# EAGLE design SparkFun_LSM303C_6_DOF_IMU_Breakout (EAGLE 7.4.0)
DESIGNER: Brent Wilkins; VERSION: v10
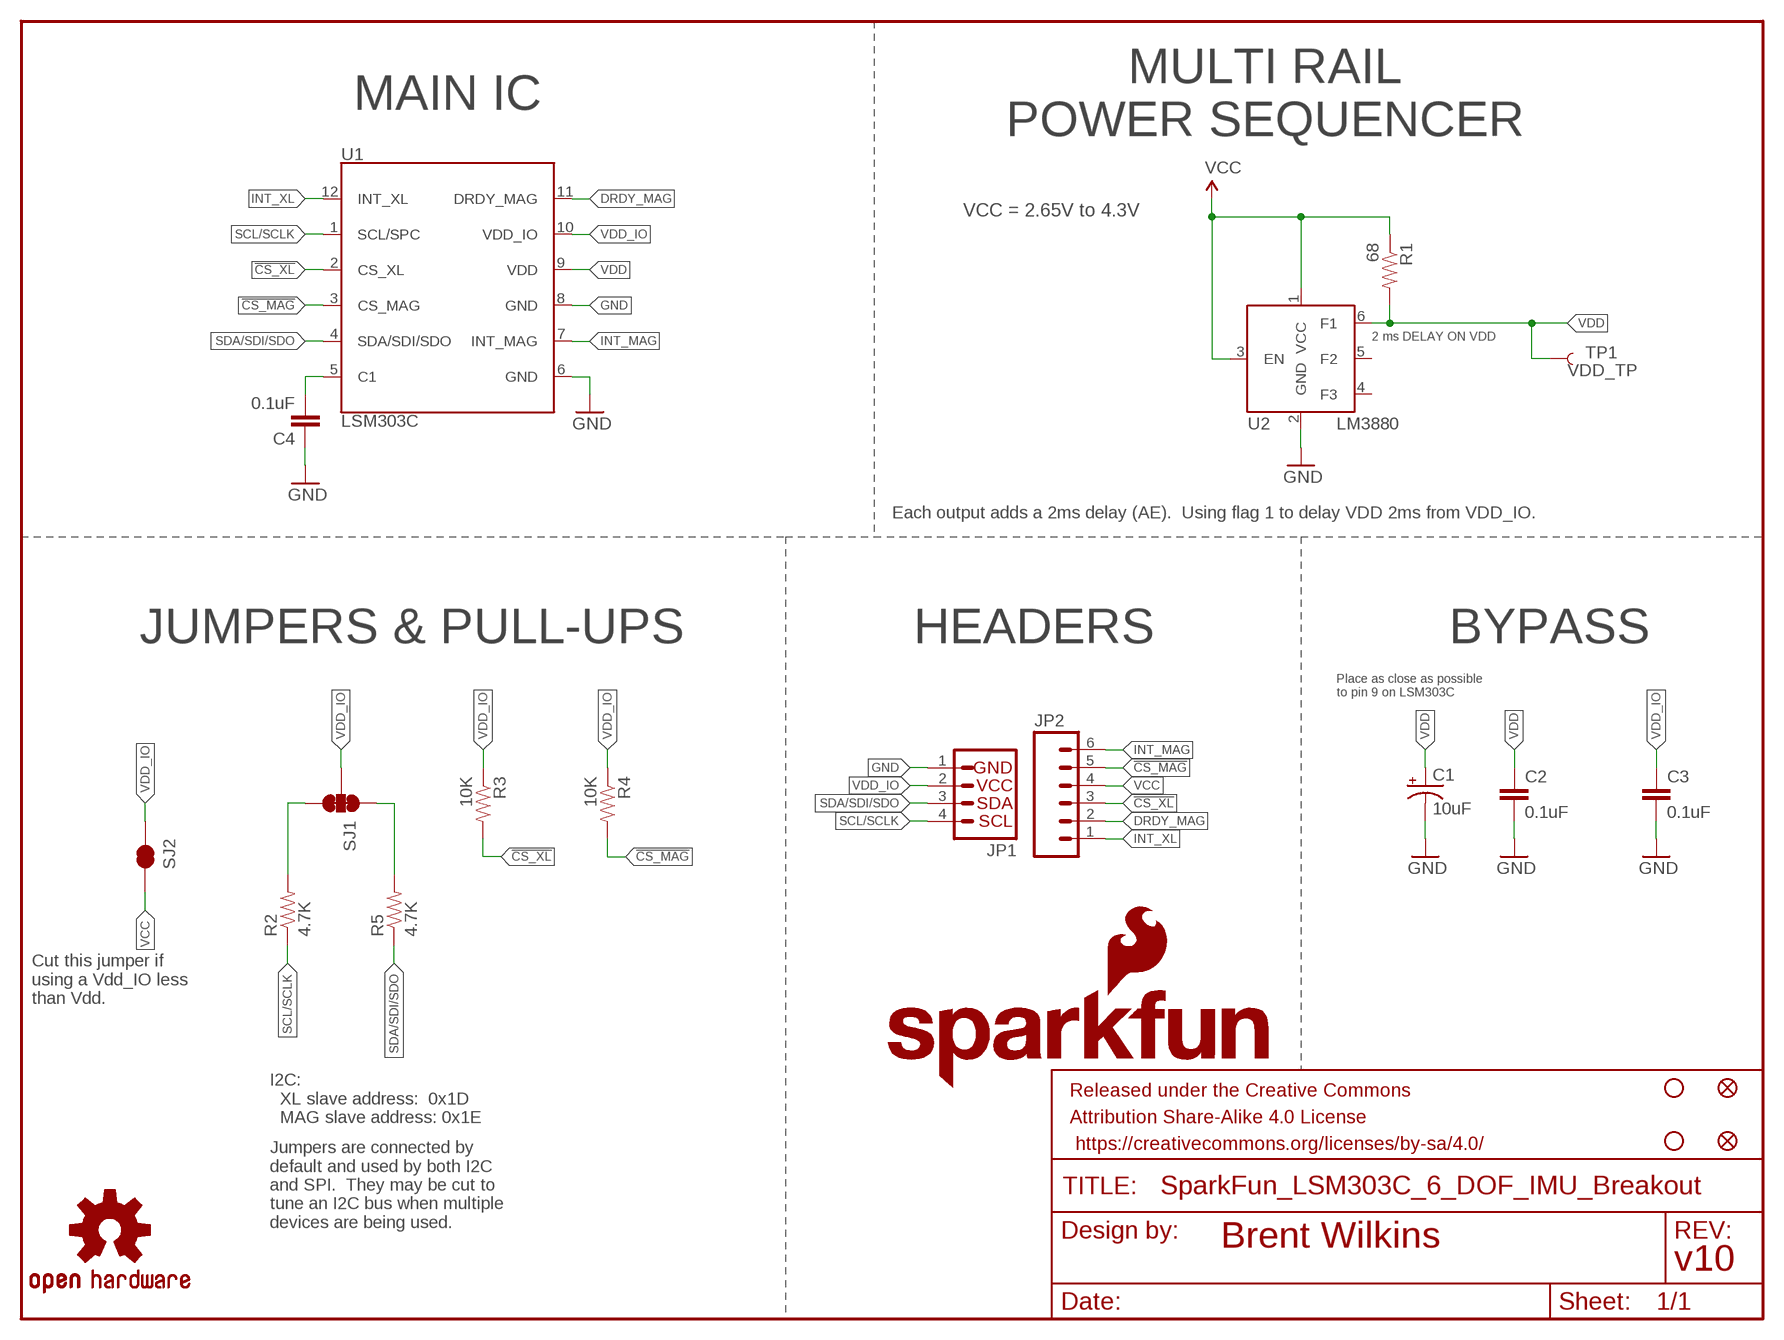
[diagram p0: schematic, sheet 1]

## Parts
C1  10uF  CAP_POL1206  [EIA3216]
C2  0.1uF  0.1UF-25V(+80/-20%)(0603)  [0603-CAP]
C3  0.1uF  0.1UF-25V(+80/-20%)(0603)  [0603-CAP]
C4  0.1uF  0.1UF-25V(+80/-20%)(0603)  [0603-CAP]
FID1  FIDUCIAL1X2  [FIDUCIAL-1X2]
FID2  FIDUCIAL1X2  [FIDUCIAL-1X2]
FRAME1  FRAME-LETTER  [CREATIVE_COMMONS]
JP1  I2C_STANDARD  [1X04]
JP2  M06SILK_FEMALE_PTH  [1X06]
LOGO1  SFE_LOGO_NAME.1_INCH  [SFE_LOGO_NAME_.1]
LOGO2  SFE_LOGO_FLAME.1EXP  [SFE_LOGO_FLAME_COPPER_EXPOSED_.1]
R1  68  RESISTOR0603-RES  [0603-RES]
R2  4.7K  4.7KOHM-1/10W-1%(0603)  [0603-RES]
R3  10K  10KOHM-1/10W-1%(0603)0603  [0603-RES]
R4  10K  10KOHM-1/10W-1%(0603)0603  [0603-RES]
R5  4.7K  4.7KOHM-1/10W-1%(0603)  [0603-RES]
SJ1  JUMPER-PAD-3-NC_BY_TRACE  [PAD-JUMPER-3-3OF3_NC_BY_TRACE_YES_SILK_FULL_BOX]
SJ2  JUMPER-PAD-2-NC_BY_TRACE  [PAD-JUMPER-2-NC_BY_TRACE_YES_SILK]
STANDOFF1  STAND-OFF  [STAND-OFF]
STANDOFF2  STAND-OFF  [STAND-OFF]
TP1  VDD_TP  TEST-POINTTP_15TH_THRU  [TP_15TH]
U1  LSM303C  [LGA-12]
U2  LM3880  LM3880/-QI  [SOT23-6]
U$8  OSHW-LOGOS  [OSHW-LOGO-S]

## Nets
!CS_MAG: JP2.5 R4.2 U1.3(CS_MAG)
!CS_XL: JP2.3 R3.2 U1.2(CS_XL)
DRDY_MAG: JP2.2 U1.11(DRDY_MAG)
GND: C1.C(-) C2.2 C3.2 C4.1 JP1.1 U1.6(GND) U1.8(GND) U2.2(GND)
I2C-UP: R5.2 SJ1.1
INT_MAG: JP2.6 U1.7(INT_MAG)
INT_XL: JP2.1 U1.12(INT_XL)
N$1: C4.2 U1.5(C1)
N$2: R2.2 SJ1.3
SCL/SCLK: JP1.4 R2.1 U1.1(SCL/SPC)
SDA/SDI/SDO: JP1.3 R5.1 U1.4(SDA/SDI/SDO)
VCC: JP2.4 R1.1 SJ2.2 U2.1(VCC) U2.3(EN)
VDD: C1.A(+) C2.1 R1.2 TP1.P$1 U1.9(VDD) U2.6(F1)
VDD_IO: C3.1 JP1.2 R3.1 R4.1 SJ1.2 SJ2.1 U1.10(VDD_IO)
Unconnected: U2.4(F3) U2.5(F2)

## Notes on the sheet
- MAIN IC
- MULTI RAIL
  POWER SEQUENCER
- VCC = 2.65V to 4.3V
- 2 ms DELAY ON VDD
- Each output adds a 2ms delay (AE).  Using flag 1 to delay VDD 2ms from VDD_IO.
- JUMPERS & PULL-UPS | HEADERS | BYPASS
- Place as close as possible
  to pin 9 on LSM303C
- Cut this jumper if
  using a Vdd_IO less
  than Vdd.
- I2C:
    XL slave address:  0x1D
    MAG slave address: 0x1E
- Jumpers are connected by
  default and used by both I2C
  and SPI.  They may be cut to
  tune an I2C bus when multiple
  devices are being used.

## Library data of the parts
C1 = SparkFun:CAP_POL: Capacitor Polarized These are standard SMD and PTH capacitors. Normally 10uF, 47uF, and 100uF in electrolytic and tantalum varieties. Always verify the external diameter of the through hole cap, it varies with capacity, voltage, and manufacturer. The EIA devices should be standard.; PROD_ID: CAP-00811
C2-C4 = SparkFun-Capacitors:0.1UF-25V(+80/-20%)(0603): CAP-00810 Ceramic Standard decoupling cap; PROD_ID: CAP-00810
FID1 FID2 = SparkFun:FIDUCIAL: Fiducial Alignment Points Various fiducial points for machine vision alignment.
FRAME1 = SparkFun-Aesthetics:FRAME-LETTER: Schematic Frame Standard 8.5x11 US Letter frame
JP1 = SparkFun-Connectors:I2C_STANDARD: SparkFun has standardized on a pinout for all I2C based sensor breakouts. This pinout allows I2C boards to be plugged directly into the headers on Arduino Uno compatible boards, and to be daisy chained easily.
JP2 = SparkFun-Connectors:M06: Header 6 Standard 6-pin 0.1" header. Use with straight break away headers (SKU : PRT-00116), right angle break away headers (PRT-00553), swiss pins (PRT-00743), machine pins (PRT-00117), and female headers (PRT-00115). Molex polarized connector foot print use with SKU : PRT-08094 with associated crimp pins and housings. NOTES ON THE VARIANTS LOCK and LOCK_LONGPADS... This footprint was designed to help hold the alignment of a through-hole component (i.e. 6-pin header) while soldering it into place. You may notice that each hole has been shifted either up or down by 0.005 of an inch from it's more standard position (which is a perfectly straight line). This slight alteration caused the pins (the squares in the middle) to touch the edges of the holes. Because they are alternating, it causes a "brace" to hold the component in place. 0.005 has proven to be the perfect amount of "off-center" position when using our standard breakaway headers. Although looks a little odd when you look at the bare footprint, once you have a header in there, the alteration is very hard to notice. Also,if you push a header all the way into place, it is covered up entirely on the bottom side. This idea of altering the position of holes to aid alignment will be further integrated into the Sparkfun Library for other footprints. It can help hold any component with 3 or more connection pins.; PROD_ID: CONN-08437
LOGO1 = SparkFun-Aesthetics:SFE_LOGO_NAME: SFE Logo, name only This is the SparkFun name logo. The logo on the schematic will always be the same size; the package variant is the height of the flame part of the logo (or the height the flame would be, if it were drawn). Default layer for the logo on the board is tSilk.
LOGO2 = SparkFun-Aesthetics:SFE_LOGO_FLAME: SFE Logo, flame only This is the SparkFun flame logo. The logo on the schematic will always be the same size; the package variant is the height of the flame. Default layer for the logo on the board is tSilk.
R1 = SparkFun-Passives:RESISTOR: Resistor Basic schematic elements and footprints for 0603, 1206, and PTH resistors.; PROD_ID: RES-07860
R2 R5 = SparkFun-Resistors:4.7KOHM-1/10W-1%(0603): RES-07857; PROD_ID: RES-07857
R3 R4 = SparkFun-Resistors:10KOHM-1/10W-1%(0603): RES-00824; PROD_ID: RES-00824
SJ1 = SparkFun-Passives:JUMPER-PAD-3-NC_BY_TRACE
SJ2 = SparkFun-Passives:JUMPER-PAD-2-NC_BY_TRACE
STANDOFF1 STANDOFF2 = SparkFun-Electromechanical:STAND-OFF: #4 Stand Off This is the mechanical footprint for a #4 phillips button head screw. Use the keepout ring to avoid running the screw head into surrounding components. SKU : PRT-00447
TP1 = SparkFun-Passives:TEST-POINT: Bare copper test points for troubleshooting or ICT
U1 = SparkFun-DigitalIC:LSM303C: Ultra-compact high-performance eCompass module: 3D accelerometer and 3D magnetometer http://www.st.com/st-web-ui/static/active/en/resource/technical/document/datasheet/DM00089896.pdf; PROD_ID: IC-12557
U2 = SparkFun-DigitalIC:LM3880/-QI: Simple Power Sequencer Precision enable pin & 3 open-drain output flags Input Voltage Range of 2.7 V to 5.5 V Power-Up and Power-Down Control LM3880MF-1XY (Timing Designator) AF 16ms AE 2ms AA 10ms AB 30ms AC 60ms AD 120ms The timing sequence of the LM3880 is controlled entirely by the enable (EN) pin. Upon power up, all the flags are held low until this precision enable is pulled high; PROD_ID: IC-12558
U$8 = SparkFun:OSHW-LOGO: Open Source Hardware Logo This logo indicates the piece of hardware it is found on incorporates a OSHW license and/or adheres to the definition of open source hardware found here: http://freedomdefined.org/OSHW

## Board
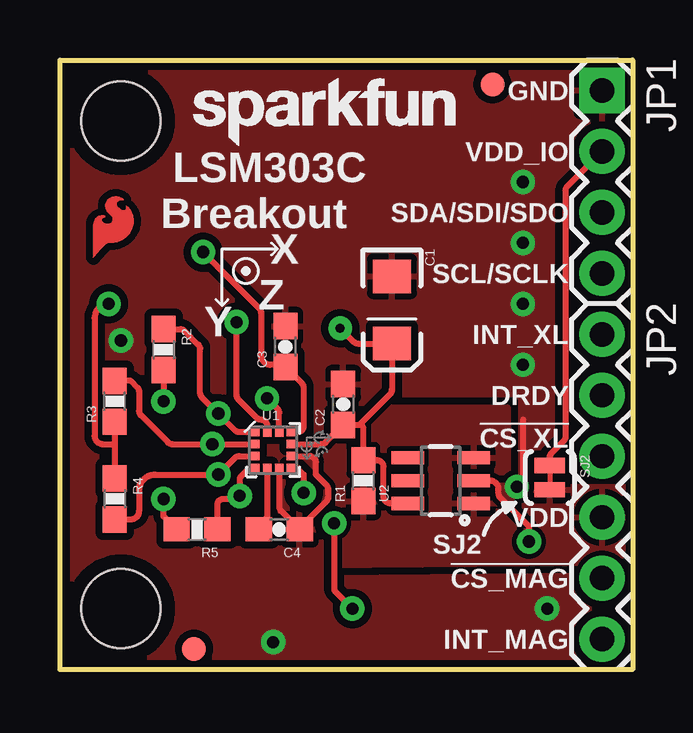
[diagram p1: board, top side]
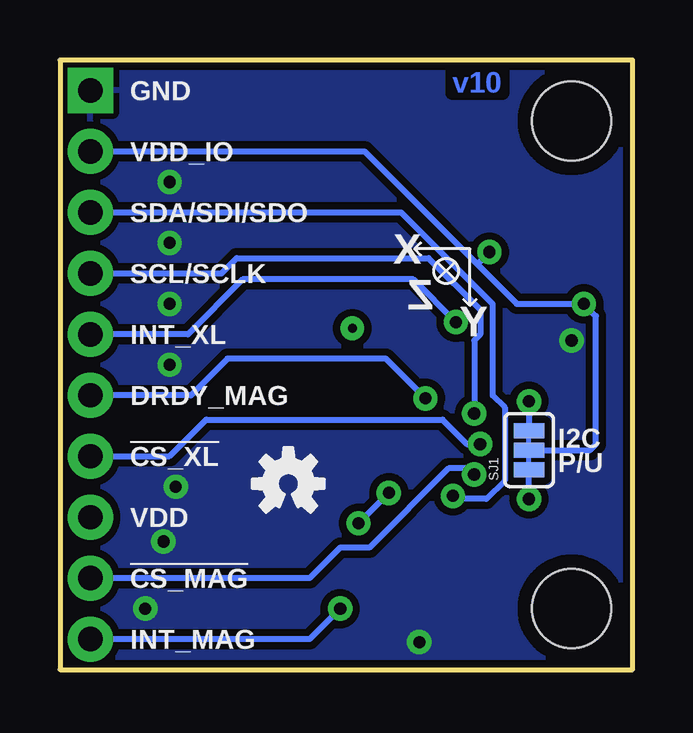
[diagram p2: board, bottom side, seen from below]

Size 23.88 x 25.4 mm. Coordinates in mm from the lower left corner, seen from the top.
Outline: 0,0 0,25.4 23.88,25.4 23.88,0 0,0
Copper layers (1*16): Top 0.035mm / dielectric 1.5mm / Bottom 0.035mm
Design rules "SparkFun-2-layer": minimum track width 7mil, minimum drill 15mil, track to track 8mil, track to pad 8mil, pad to pad 8mil, via to via 8mil, smd to smd 8mil, copper to edge 8mil, drill to drill 8mil, minimum pad ring 12mil, minimum via ring 10mil, stop-mask expansion 4mil, vias tented up to drill 20mil, thermal gap 10mil

### Footprints (pad centres in the part's own frame; a part is rotated, then mirrored left to right if it is on the bottom)
EIA3216 = smd 1.4 x 1.6: A 1.4,0; C -1.4,0
0603-CAP = smd 1.1 x 1: 1 -0.85,0; 2 0.85,0
FIDUCIAL-1X2 = smd 1 x 1: 1 0,0
1X04 = drill 1.016 pad 1.88 square: 1 0,0 | drill 1.016 pad 1.88: 2 2.54,0; 3 5.08,0; 4 7.62,0
1X06 = drill 1.016 pad 1.88: 1 0,0; 2 2.54,0; 3 5.08,0; 4 7.62,0; 5 10.16,0; 6 12.7,0
0603-RES = smd 1.1 x 1: 1 -0.85,0; 2 0.85,0
PAD-JUMPER-3-3OF3_NC_BY_TRACE_YES_SILK_FULL_BOX = smd 0.635 x 1.27: 1 -0.813,0; 2 0,0; 3 0.813,0
PAD-JUMPER-2-NC_BY_TRACE_YES_SILK = smd 0.635 x 1.27: 1 -0.508,0; 2 0.508,0
STAND-OFF = hole 3.302: 0,0
TP_15TH = drill 0.381 pad 0.61: P$1 0,0
LGA-12 = smd 0.375 x 0.35: 1 -0.75,0.75; 2 -0.75,0.25; 3 -0.75,-0.25; 4 -0.75,-0.75; 7 0.75,-0.75; 8 0.75,-0.25; 9 0.75,0.25; 10 0.75,0.75 | smd 0.35 x 0.375: 5 -0.25,-0.75; 6 0.25,-0.75; 11 0.25,0.75; 12 -0.25,0.75
SOT23-6 = smd 0.55 x 1.35: 1 -0.95,-1.375; 2 0,-1.375; 3 0.95,-1.375; 4 0.95,1.375; 5 0,1.375; 6 -0.95,1.375

### Placement (x,y rotation side)
C1  13.84,14.99 270 top
C2  11.81,11.05 90 top
C3  9.4,13.46 90 top
C4  9.14,5.84 180 top
FID1  18.03,24.38 0 top
FID2  5.59,0.86 0 top
FRAME1  -22.23,-14.1 0 top  (outside the outline)
JP1  22.61,24.13 270 top
JP2  22.61,13.97 270 top
LOGO1  5.08,21.34 0 top
LOGO2  1.07,16.81 0 top
R1  12.65,7.87 90 top
R2  4.32,13.34 270 top
R3  2.29,11.18 90 top
R4  2.29,7.11 270 top
R5  5.71,5.84 180 top
SJ1  4.32,9.14 90 bottom
SJ2  20.42,8 270 top
STANDOFF1  2.54,22.86 0 top
STANDOFF2  2.54,2.54 0 top
TP1  11.68,14.22 0 top
U1  8.89,9.14 0 top
U2  15.88,7.87 90 top
U$8  14.35,7.75 0 bottom

### Tracks (layer width: path | path; a pad name or v marks a point on that pad's centre or on a via)
!CS_MAG  (via drill 0.51)
  Top 0.254: U1.3 7.47,8.89 arc45 7.3,8.82 v6.6,8.13 3.98,8.13 arc90 3.3,7.45 3.3,6.6 arc-90 2.96,6.26 R4.2
  Bottom 0.254: v6.6,8.13 6.86,8.38 7.67,8.38 10.97,5.08 12.19,5.08 13.46,3.81 JP2.5
!CS_XL  (via drill 0.51)
  Top 0.254: U1.2 v6.35,9.39 4.68,9.39 arc-45 4.5,9.47 3.38,10.59 arc-45 3.3,10.77 3.3,11.58 arc45 3.23,11.76 2.96,12.03 R3.2
  Bottom 0.254: JP2.3 19.3,8.89 17.78,10.41 7.92,10.41 6.91,9.4 v6.36,9.4 v6.35,9.39
DRDY_MAG  (via drill 0.51)
  Top 0.254: U1.11 9.14,10.69 arc45 9.07,10.87 v8.64,11.3
  Bottom 0.254: v8.64,11.3 10.29,12.95 16.89,12.95 18.41,11.43 JP2.2
GND  (via drill 0.51)
  Top 0.254: U1.6 9.14,6.8 arc45 9.22,6.62 C4.1 | U1.8 10.41,8.89 arc-90 10.67,8.64 10.67,8.13 11.1,7.69 arc-45 11.18,7.51 11.18,7.16 arc-45 11.11,7.01 10.03,5.93 arc45 C4.1 | 9.91,5.84 C4.1 | 19.3,10.41 19.3,7.87 v19.05,7.62 | v19.56,5.33 19.56,5.97 18.36,7.17 arc-45 18.29,7.34 18.29,7.52 arc90 17.93,7.87 U2.2
  other vias: 19.3,17.78 19.3,15.24 19.3,20.32 8.89,1.14 20.32,2.54 19.3,12.7 2.54,13.72
  pour Top (isolate 0.305, rank 6): 0,0 0,25.4 23.88,25.4 23.88,0
  pour Bottom (isolate 0.305): 0,0 0,25.4 23.88,25.4 23.88,0
I2C-UP  (via drill 0.51)
  Top 0.254: R5.2 4.32,6.39 v4.32,7.11
  Bottom 0.254: v4.32,7.11 SJ1.1
INT_MAG  (via drill 0.51)
  Top 0.254: U1.7 9.89,8.39 10.16,8.13 v10.16,7.37 | v11.43,6.1 11.43,3.41 arc45 11.5,3.23 v12.19,2.54
  Bottom 0.254: JP2.6 13.46,1.27 v12.19,2.54 | v10.16,7.37 v11.43,6.1
INT_XL  (via drill 0.51)
  Top 0.254: v7.37,14.48 7.37,11.43 arc45 7.44,11.25 8.21,10.49 arc45 8.39,10.41 arc-90 8.64,10.16 U1.12 8.64,10.16
  Bottom 0.254: JP2.1 18.54,13.97 16.26,16.26 9.14,16.26 v7.37,14.48
N$1
  Top 0.254: U1.5 8.64,6.35 8.29,6.01 C4.2 8.38,5.93
N$2  (via drill 0.51)
  Top 0.254: R2.2 v4.32,11.18
  Bottom 0.254: v4.32,11.18 SJ1.3
SCL/SCLK  (via drill 0.51)
  Top 0.254: R2.1 5.01,14.19 arc-45 5.19,14.11 5.77,13.54 arc-45 5.84,13.36 5.84,11.54 arc45 5.92,11.36 v6.6,10.67 7.3,9.97 arc45 7.48,9.89 U1.1
  Bottom 0.254: JP1.4 17.14,16.51 16.51,17.14 8.51,17.14 6.35,14.99 6.35,13.97 6.6,13.72 v6.6,10.67
SDA/SDI/SDO  (via drill 0.51)
  Top 0.254: U1.4 7.89,8.39 7.57,8.07 arc45 7.49,7.9 v7.49,7.24 7.37,7.11 6.81,7.11 arc90 6.57,6.87 R5.1
  Bottom 0.254: JP1.3 9.65,19.05 5.84,15.24 5.84,11.43 5.33,10.92 5.33,7.87 6.1,7.11 7.37,7.11 v7.49,7.24
VCC
  pour Top: 23.88,7.62 23.88,4.45 10.79,4.32 10.79,10.92 18.67,10.92 18.67,7.62
VDD
  Top 0.254: 12.48,10.2 C2.1 11.08,9.47 arc-45 10.9,9.39 U1.9 | 12.48,10.2 arc-90 12.65,10.04 R1.2 13.22,8.72 arc-45 13.4,8.65 13.41,8.63 arc-45 13.49,8.46 13.49,7.24 arc90 13.8,6.92 U2.6 | 12.48,10.2 13.77,11.48 arc45 13.84,11.66 C1.A 12.43,13.59 arc-45 12.25,13.66 TP1.P$1
VDD_IO  (via drill 0.51)
  Top 0.254: U1.10 9.65,9.91 9.91,9.91 9.89,9.89 U1.10 | R3.1 2.29,9.4 | 2.29,9.4 R4.1 | v2.03,15.24 arc90 1.45,14.66 1.45,9.73 arc90 1.78,9.4 2.29,9.4 | 9.4,12.7 8.74,12.7 arc-45 8.56,12.77 8.46,12.88 arc-45 8.38,13.06 8.38,14.88 arc45 8.31,15.06 v5.97,17.4 | JP1.2 21.16,20.14 arc45 21.08,19.96 21.08,9.71 arc-45 21.01,9.53 20.5,9.02 arc45 20.42,8.84 SJ2.1 | C3.1 10.09,11.92 arc-45 10.16,11.74 10.16,10.15 arc-90 9.91,9.89 U1.10
  Top 0.406: 9.4,12.7 C3.1
  Bottom 0.254: SJ1.2 1.78,9.14 1.52,9.4 1.52,14.73 v2.03,15.24 4.83,15.24 6.48,16.89 | JP1.2 11.18,21.59 6.48,16.89 | v5.97,17.4 6.48,16.89

### Text on the board
tPlace: GND | VDD_IO | SDA/SDI/SDO | LSM303C / Breakout | X | SCL/SCLK | Z | Y | INT_XL | DRDY | !CS_XL! | VDD | SJ2 | !CS_MAG | INT_MAG
bPlace: GND | VDD_IO | SDA/SDI/SDO | X | SCL/SCLK | Z | Y | INT_XL | DRDY_MAG | I2C | P/U | !CS_XL | VDD | !CS_MAG | INT_MAG
Measures: All units in inches